# Altium schematic sheet 00_Main.SchDoc
size A4
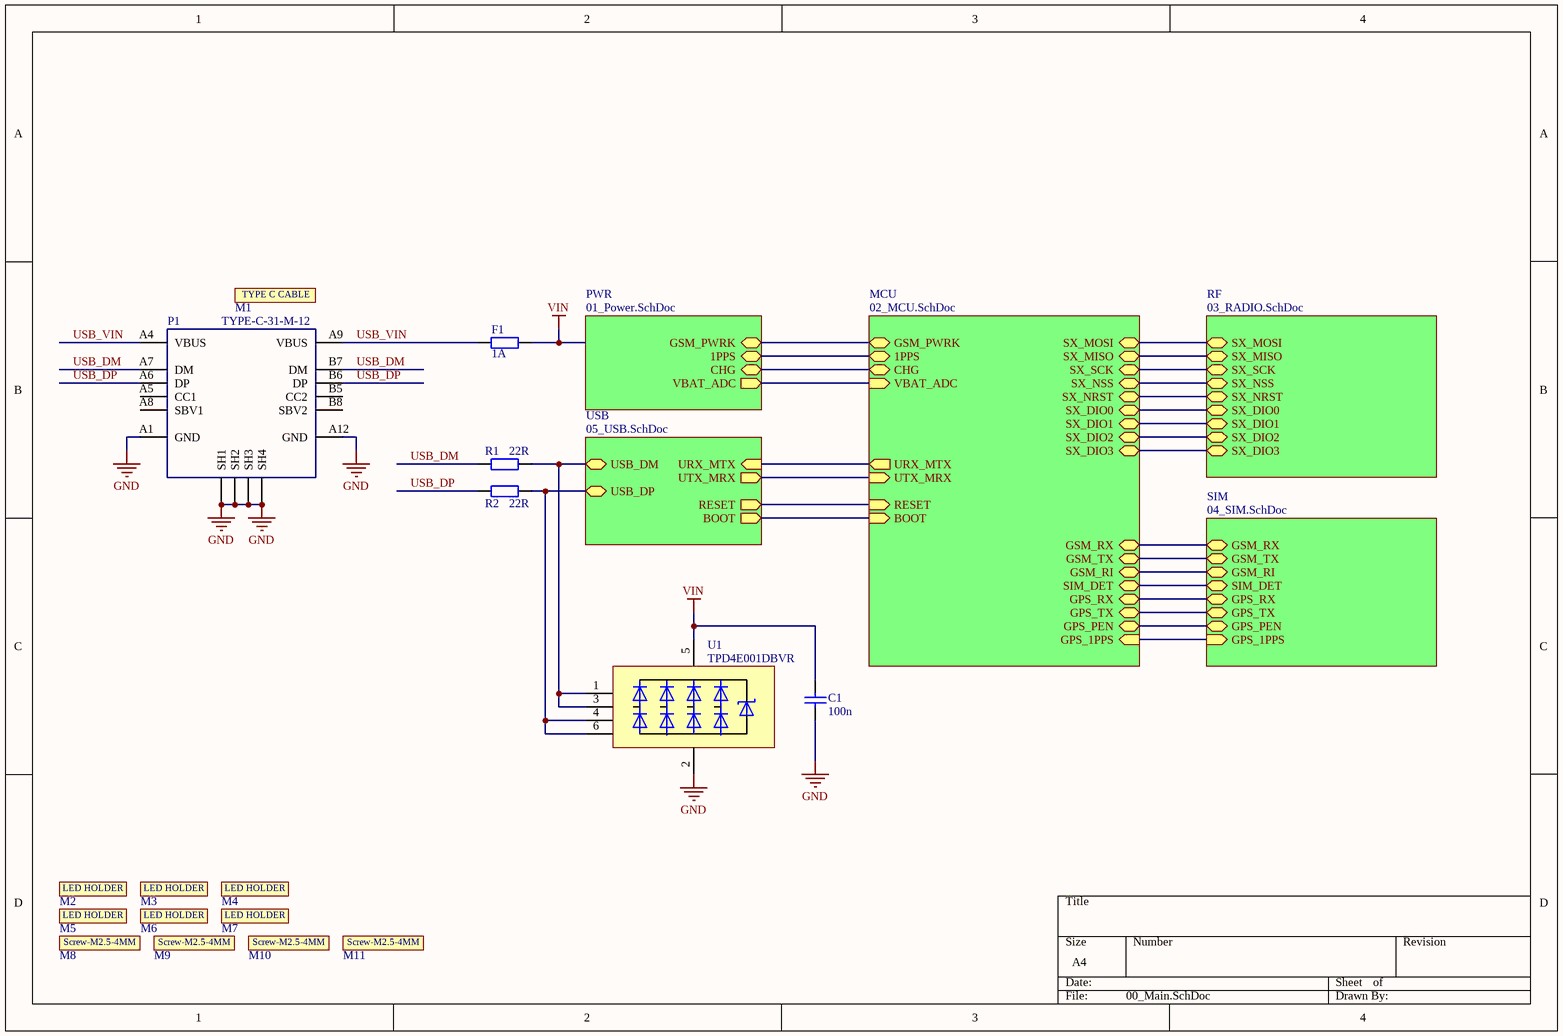
[diagram p0: 00_Main.SchDoc]

## Parts
C1  100n  [C0603_IPC_MD]
F1  1A  [R0603_IPC_MD]
M1  UGREEN-PVC-TYPE-C  (value not drawn)  (mechanical)
M2  LedHolderM3  (value not drawn)  (mechanical)
M3  LedHolderM3  (value not drawn)  (mechanical)
M4  LedHolderM3  (value not drawn)  (mechanical)
M5  C94096  [LED3MM_HOLDER]  (value not drawn)  (mechanical)
M6  C94096  [LED3MM_HOLDER]  (value not drawn)  (mechanical)
M7  C94096  [LED3MM_HOLDER]  (value not drawn)  (mechanical)
M8  ScrewST-M3-6MM  (value not drawn)  (mechanical)
M9  ScrewST-M3-6MM  (value not drawn)  (mechanical)
M10  ScrewST-M3-6MM  (value not drawn)  (mechanical)
M11  ScrewST-M3-6MM  (value not drawn)  (mechanical)
P1  TYPE-C-31-M-12  [TYPE-C-C165948]
R1  22R  [R0603_IPC_MD]
R2  22R  [R0603_IPC_MD]
U1  TPD4E001DBVR  [SOT23-6]

## Sub-sheets
MCU = 02_MCU.SchDoc: GSM_PWRK, URX_MTX (out), UTX_MRX (in), SX_MOSI, SX_MISO, SX_SCK, SX_NSS, SX_NRST, SX_DIO1, SX_DIO2, SX_DIO3, SX_DIO0, GSM_RX, GSM_TX, GSM_RI, GPS_RX, GPS_TX, GPS_PEN, GPS_1PPS (in), SIM_DET, 1PPS, CHG, RESET (in), BOOT (in), VBAT_ADC (in)
PWR = 01_Power.SchDoc: GSM_PWRK, 1PPS, CHG, VBAT_ADC (out)
RF = 03_RADIO.SchDoc: SX_MOSI, SX_MISO, SX_SCK, SX_NSS, SX_NRST, SX_DIO0, SX_DIO1, SX_DIO2, SX_DIO3
SIM = 04_SIM.SchDoc: GSM_RX, GSM_TX, GSM_RI, GPS_RX, GPS_TX, GPS_PEN, GPS_1PPS (in), SIM_DET
USB = 05_USB.SchDoc: USB_DP, USB_DM, URX_MTX (in), UTX_MRX (out), RESET (out), BOOT (out)

## Nets
GND: C1.2 P1.A1(GND) P1.A12(GND) P1.SH1 P1.SH2 P1.SH3 P1.SH4 U1.2(GND)
VIN: C1.1 F1.2 U1.5(VCC)
USB_DM: P1.A7(DM) P1.B7(DM) R1.1
USB_DP: P1.A6(DP) P1.B6(DP) R2.1
USB_VIN: F1.1 P1.A4(VBUS) P1.A9(VBUS)
NetR1_2: R1.2 U1.1(IO1) U1.3(IO2) ; sheet USB/USB_DM
NetR2_2: R2.2 U1.4(IO3) U1.6(IO4) ; sheet USB/USB_DP
(unnamed): sheet USB/URX_MTX, sheet MCU/URX_MTX
(unnamed): sheet USB/UTX_MRX, sheet MCU/UTX_MRX
(unnamed): sheet USB/RESET, sheet MCU/RESET
(unnamed): sheet USB/BOOT, sheet MCU/BOOT
(unnamed): sheet PWR/GSM_PWRK, sheet MCU/GSM_PWRK
(unnamed): sheet PWR/1PPS, sheet MCU/1PPS
(unnamed): sheet PWR/CHG, sheet MCU/CHG
(unnamed): sheet PWR/VBAT_ADC, sheet MCU/VBAT_ADC
(unnamed): sheet SIM/GSM_RX, sheet MCU/GSM_RX
(unnamed): sheet SIM/GSM_TX, sheet MCU/GSM_TX
(unnamed): sheet SIM/GSM_RI, sheet MCU/GSM_RI
(unnamed): sheet SIM/GPS_RX, sheet MCU/GPS_RX
(unnamed): sheet SIM/GPS_TX, sheet MCU/GPS_TX
(unnamed): sheet SIM/GPS_PEN, sheet MCU/GPS_PEN
(unnamed): sheet SIM/GPS_1PPS, sheet MCU/GPS_1PPS
(unnamed): sheet SIM/SIM_DET, sheet MCU/SIM_DET
(unnamed): sheet MCU/SX_MOSI, sheet RF/SX_MOSI
(unnamed): sheet MCU/SX_MISO, sheet RF/SX_MISO
(unnamed): sheet MCU/SX_SCK, sheet RF/SX_SCK
(unnamed): sheet MCU/SX_NSS, sheet RF/SX_NSS
(unnamed): sheet MCU/SX_NRST, sheet RF/SX_NRST
(unnamed): sheet MCU/SX_DIO1, sheet RF/SX_DIO1
(unnamed): sheet MCU/SX_DIO2, sheet RF/SX_DIO2
(unnamed): sheet MCU/SX_DIO3, sheet RF/SX_DIO3
(unnamed): sheet MCU/SX_DIO0, sheet RF/SX_DIO0

Not connected (* = marked no-connect by the designer): P1 A5(CC1) A8(SBV1) B5(CC2) B8(SBV2)

## Notes on the sheet
- (in symbol C94096) LED HOLDER
- (in symbol LED-HOLDER-M3) LED HOLDER
- (in symbol ScrewST-M3-6MM) Screw-M2.5-4MM
- (in symbol TYPE-C-CABLE) TYPE C CABLE

## Library data of the parts
C1 = CL10B104KO8NNNC: CAP CER 0.1UF 16V X7R 0603; Manufacturer: Samsung Electro-Mechanics; Manufacturer Part Number: CL10B104KO8NNNC; Voltage: 16V; Value: 100n; Dielectric: X7R; Supplier 1: Digi-Key; Supplier Part Number 1: 1276-1005-1-ND
F1 = MFU0603FF01000P500: FUSE BOARD MOUNT 1A 32VDC 0603; Manufacturer: Bourns Inc.; Value: 1A; Manufacturer Part Number: MFU0603FF01000P500; Supplier 1: Digi-Key; Supplier Part Number 1: 749-1742-1-ND
M1 = TYPE-C-CABLE: Ugreen USB Type C Cable; Manufacturer: China; Manufacturer Part Number: UGREEN-PVC-TYPE-C; Supplier 1: Aliexpress; Supplier Part Number 1: UGREEN-PVC-TYPE-C; Link: https://www.aliexpress.com/item/32421088643.html?spm=2114.12010612.8148356.8.24b5310anwdN5o
M2-M4 = LED-HOLDER-M3: Manufacturer: China; Manufacturer Part Number: LedHolderM3; Supplier 1: Aliexpress; Supplier Part Number 1: LedHolderM3
M5-M7 = C94096: LED Light Pipes 4*10 RoHS; Manufacturer: HIWA; Manufacturer Part Number: C94096; Supplier 1: LCSC; Supplier Part Number 1: C94096
M8-M11 = ScrewST-M3-6MM: Manufacturer: China; Manufacturer Part Number: ScrewST-M3-6MM; Supplier 1: Aliexpress; Supplier Part Number 1: ScrewST-M3-6MM
P1 = TYPE-C-31-M-12: TYPE C PCB TH CONN; Manufacturer: Korean Hroparts Elec; Manufacturer Part Number: TYPE-C-31-M-12; Supplier 1: LCSC; Supplier Part Number 1: C165948
R1 R2 = CR0603-JW-220ELF: RES SMD 22 OHM 5% 1/10W 0603; Manufacturer: Bourns Inc.; Value: 22R; Tolarance: 5%; Manufacturer Part Number: CR0603-JW-220ELF; Supplier 1: Digi-Key; Supplier Part Number 1: CR0603-JW-220ELFCT-ND
U1 = TPD4E001DBVR: 4x TVS DIODE 5.5V SOT23-6; Manufacturer: TI; Manufacturer Part Number: TPD4E001DBVR; Supplier 1: Digi-Key; Supplier Part Number 1: 296-28203-1-ND